# EAGLE design RecoveryBoard (EAGLE 9.5.1)

## Sheet 1 of 2: Power
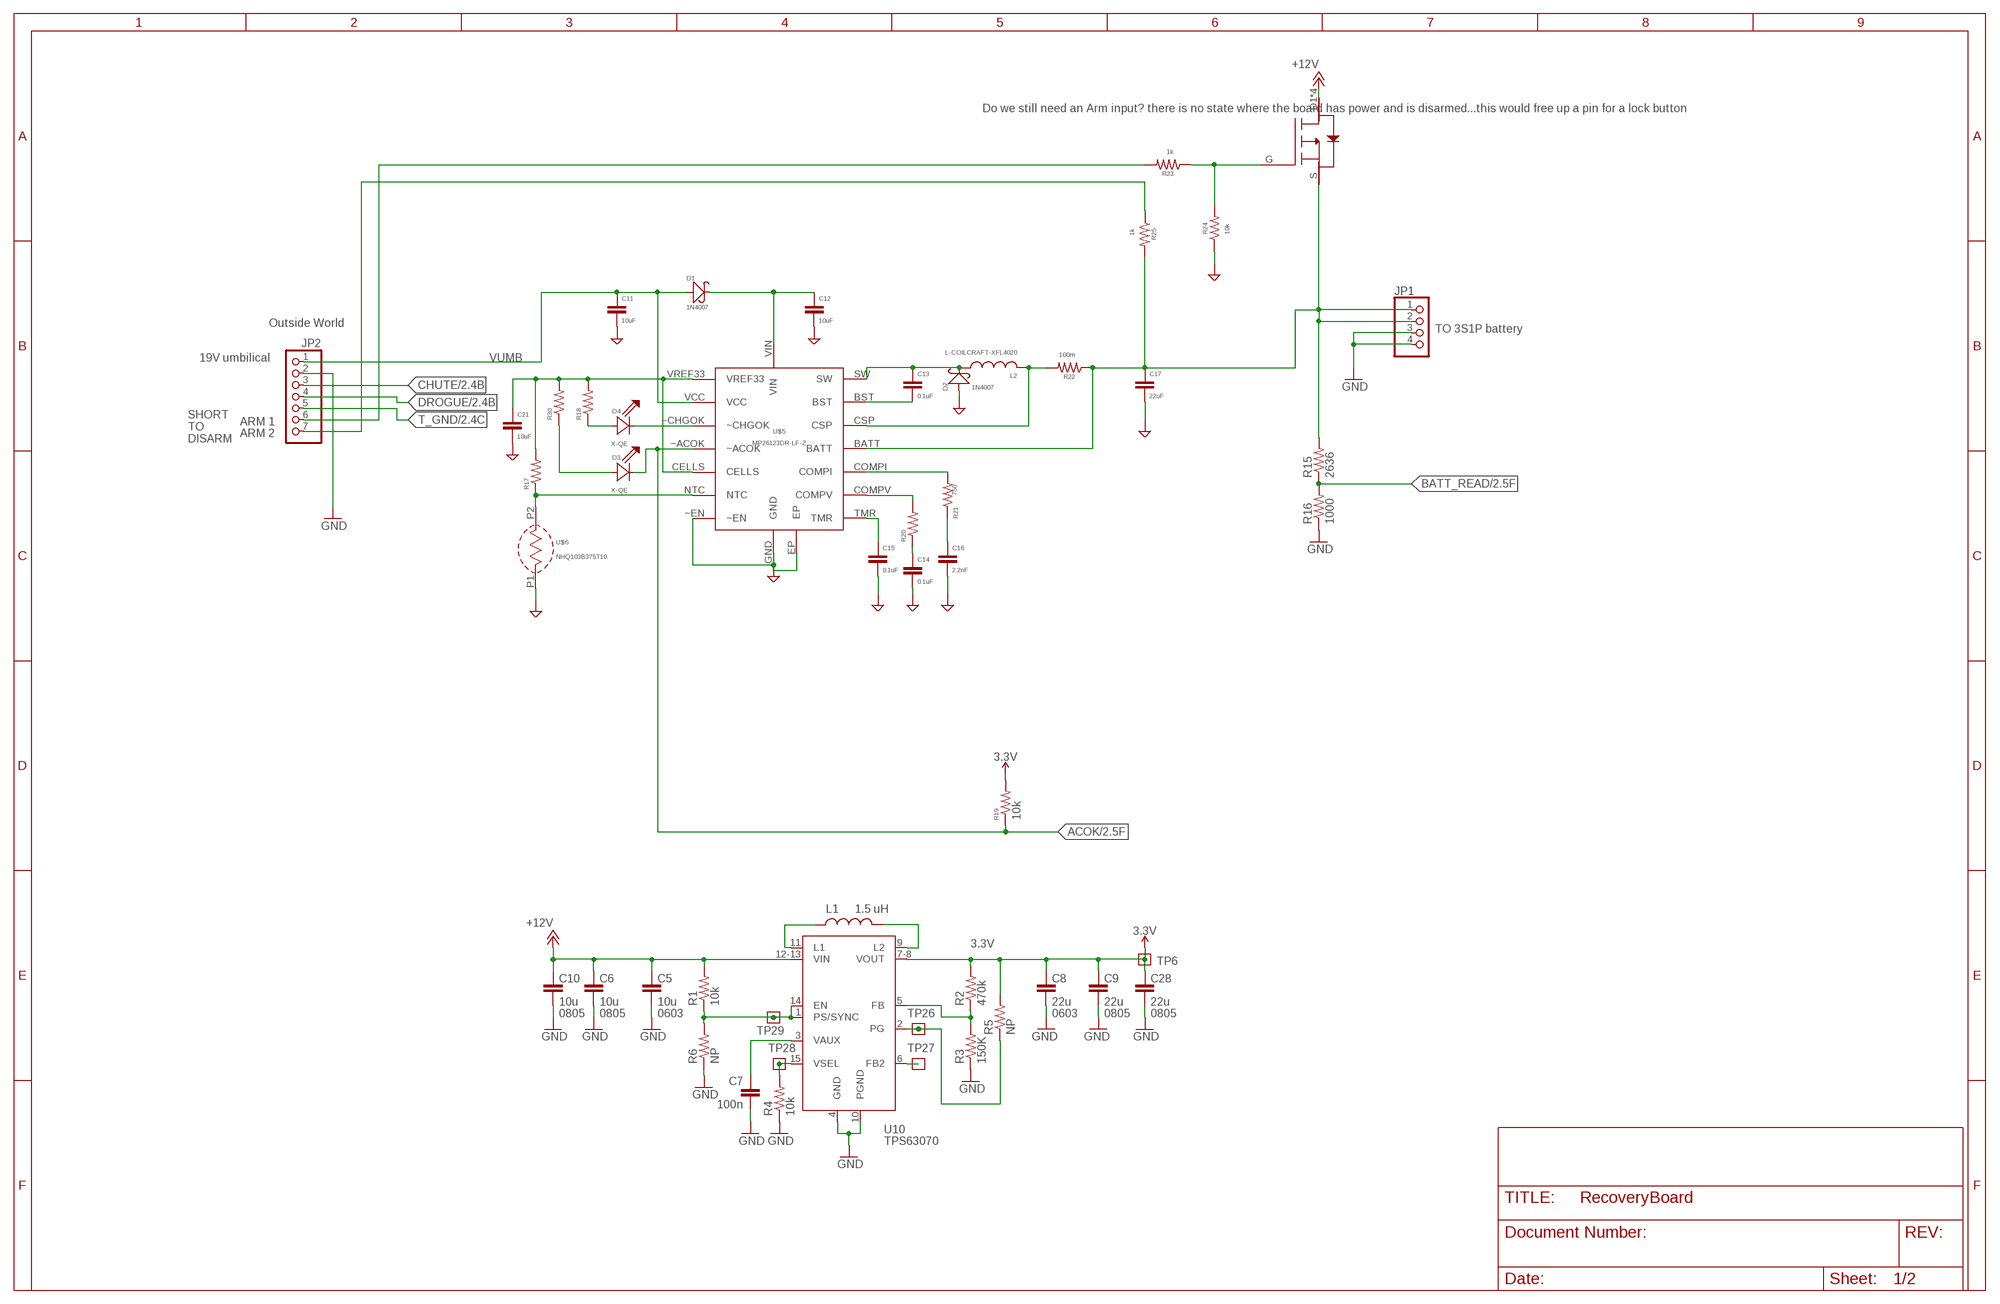
[diagram p0: schematic, sheet 1]

### Parts
C5  10u  C-EU0603-B-NOSILK  [.0603-B-NOSILK]
C6  10u  C-EU0805-B-NOSILK  [.0805-B-NOSILK]
C7  100n  C-EU0402-B-NOSILK  [.0402-B-NOSILK]
C8  22u  C-EU0603-B-NOSILK  [.0603-B-NOSILK]
C9  22u  C-EU0805-B-NOSILK  [.0805-B-NOSILK]
C10  10u  C-EU0805-B-NOSILK  [.0805-B-NOSILK]
C11  10uF  C-EU0805-C-NOSILK  [.0805-C-NOSILK]
C12  10uF  C-EU0805-C-NOSILK  [.0805-C-NOSILK]
C13  0.1uF  C-EU0603-C-NOSILK  [.0603-C-NOSILK]
C14  0.1uF  C-EU0603-C-NOSILK  [.0603-C-NOSILK]
C15  0.1uF  C-EU0603-C-NOSILK  [.0603-C-NOSILK]
C16  2.2nF  C-EU0603-C-NOSILK  [.0603-C-NOSILK]
C17  22uF  C-EU0603-C-NOSILK  [.0603-C-NOSILK]
C21  10uF  C-EU0805-C-NOSILK  [.0805-C-NOSILK]
C28  22u  C-EU0805-B-NOSILK  [.0805-B-NOSILK]
D1  1N4007  DIODE-SCHOTTKY-(DO-214AC)  [DO-214AC]
D2  1N4007  DIODE-SCHOTTKY-(DO-214AC)  [DO-214AC]
D3  X-QE  [X-QE]
D4  X-QE  [X-QE]
JP1  PINHD-1X4  [1X04]
JP2  PINHD-1X7  [1X07]
L1  1.5 uH  L-COILCRAFT-XFL4020  [L-COILCRAFT-XFL4020]
L2  L-COILCRAFT-XFL4020  [L-COILCRAFT-XFL4020]
R1  10k  R-US_0402-B-NOSILK  [.0402-B-NOSILK]
R2  470k  R-US_0402-B-NOSILK  [.0402-B-NOSILK]
R3  150K  R-US_0402-B-NOSILK  [.0402-B-NOSILK]
R4  10k  R-US_0402-B-NOSILK  [.0402-B-NOSILK]
R5  NP  R-US_0402-B-NOSILK  [.0402-B-NOSILK]
R6  NP  R-US_0402-B-NOSILK  [.0402-B-NOSILK]
R15  2636  R-US_0603-C-NOSILK  [.0603-C-NOSILK]
R16  1000  R-US_0603-C-NOSILK  [.0603-C-NOSILK]
R17  R-US_0603-C-NOSILK  [.0603-C-NOSILK]
R18  R-US_0603-C-NOSILK  [.0603-C-NOSILK]
R19  10k  R-US_0603-C-NOSILK  [.0603-C-NOSILK]
R20  R-US_0603-C-NOSILK  [.0603-C-NOSILK]
R21  750  R-US_0603-C-NOSILK  [.0603-C-NOSILK]
R22  100m  R-US_1206-C  [1206-C]
R23  1k  R-US_0603-C-NOSILK  [.0603-C-NOSILK]
R24  10k  R-US_0603-C-NOSILK  [.0603-C-NOSILK]
R25  1k  R-US_0603-C-NOSILK  [.0603-C-NOSILK]
R30  R-US_0603-C-NOSILK  [.0603-C-NOSILK]
TP6  TEST-POINT  [2MM-TEST-POINT]
TP26  TEST-POINT  [2MM-TEST-POINT]
TP27  TEST-POINT  [2MM-TEST-POINT]
TP28  TEST-POINT  [2MM-TEST-POINT]
TP29  TEST-POINT  [2MM-TEST-POINT]
U10  TPS63070  TPS63070X  [TPS63070X]
U$5  MP26123DR-LF-Z  [MP26123DR-LF-Z]
U$6  NHQ103B375T10  [NHQ103B375T10]
U$8  AO6405  [AO6405]

### Nets
3.3V: C8.1 C9.1 C28.1 R2.2 R5.2 R19.2 TP6.1 U10.7-8(VOUT) ; also sheet 2
+12V: C5.1 C6.1 C10.1 R1.2 U10.12-13(VIN) U$8.D1(D) U$8.D2(D) U$8.D3(D) U$8.D4(D) ; also sheet 2
ACOK: D3.CATHODE(C) R19.1 U$5.~ACOK ; also sheet 2
BATT_READ: R15.1 R16.2 ; also sheet 2
CHUTE: JP2.3 ; also sheet 2
DROGUE: JP2.4 ; also sheet 2
GND: C5.2 C6.2 C7.2 C8.2 C9.2 C10.2 C11.2 C12.2 C14.2 C15.2 C16.2 C17.2 C21.2 C28.2 D2.1(+) JP1.3 JP1.4 JP2.2 R3.1 R4.1 R6.1 R16.1 R24.1 U10.4(GND) U10.10(PGND) U$5.EP U$5.GND U$5.~EN U$6.P1 ; also sheet 2
N$9: C12.1 D1.2(-) U$5.VIN
N$10: C13.1 D2.2(-) L2.1 U$5.SW
N$11: C13.2 U$5.BST
N$12: C21.1 R17.2 R18.2 R30.2 U$5.CELLS U$5.VREF33
N$13: D4.CATHODE(C) U$5.~CHGOK
N$14: D3.ANODE(A) R30.1
N$15: JP2.6 R23.2
N$16: R23.1 R24.2 U$8.G
N$17: D4.ANODE(A) R18.1
N$18: R20.2 U$5.COMPV
N$19: C15.1 U$5.TMR
N$20: R17.1 U$5.NTC U$6.P2
N$21: R21.2 U$5.COMPI
N$22: C16.1 R21.1
N$23: C17.1 JP1.1 JP1.2 R15.2 R22.1 R25.2 U$5.BATT U$8.S
N$28: L2.2 R22.2 U$5.CSP
N$30: C14.1 R20.1
T_GND: JP2.5 ; also sheet 2
TPS-EN: R1.1 R6.2 TP29.1 U10.1(PS/SYNC) U10.14(EN)
TPS-FB: R2.1 R3.2 U10.5(FB)
TPS-FB2: TP27.1 U10.6(FB2)
TPS-L1: L1.1 U10.11(L1)
TPS-L2: L1.2 U10.9(L2)
TPS-PG: R5.1 TP26.1 U10.2(PG)
TPS-VAUX: C7.1 U10.3(VAUX)
TPS-VSEL: R4.2 TP28.1 U10.15(VSEL)
VBAT: JP2.7 R25.1
VUMB: C11.1 D1.1(+) JP2.1 U$5.VCC

### Notes on the sheet
- Do we still need an Arm input? there is no state where the board has power and is disarmed...this would free up a pin for a lock button
- Outside World
- TO 3S1P battery
- 19V umbilical
- ARM 1
- ARM 2
- SHORT
  TO
  DISARM
- 0805 | 0805 | 0603 | 0603 | 0805 | 0805

## Sheet 2 of 2: Microcontroller
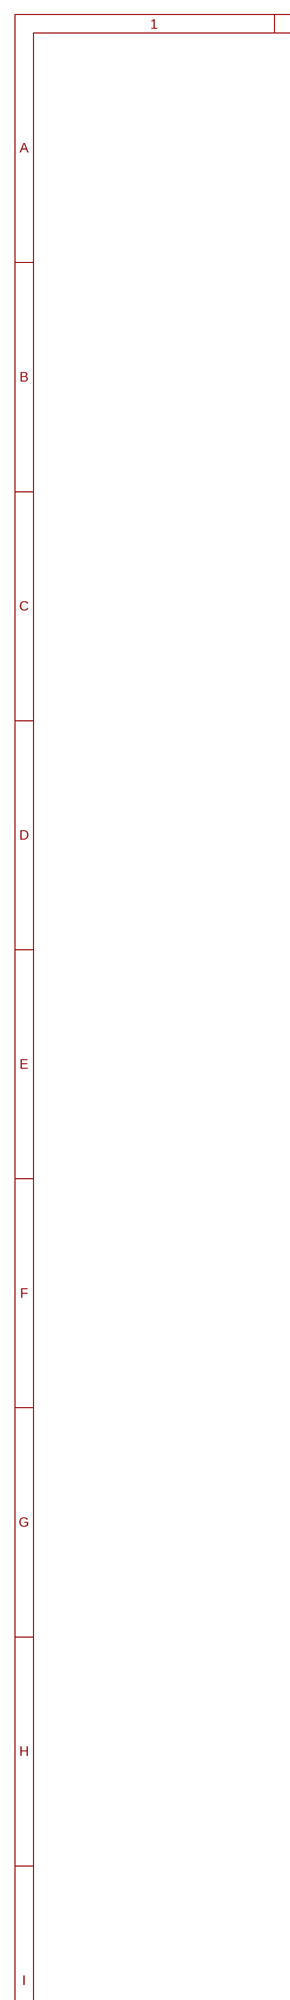
[diagram p1: schematic, sheet 2, part 1 of 2]
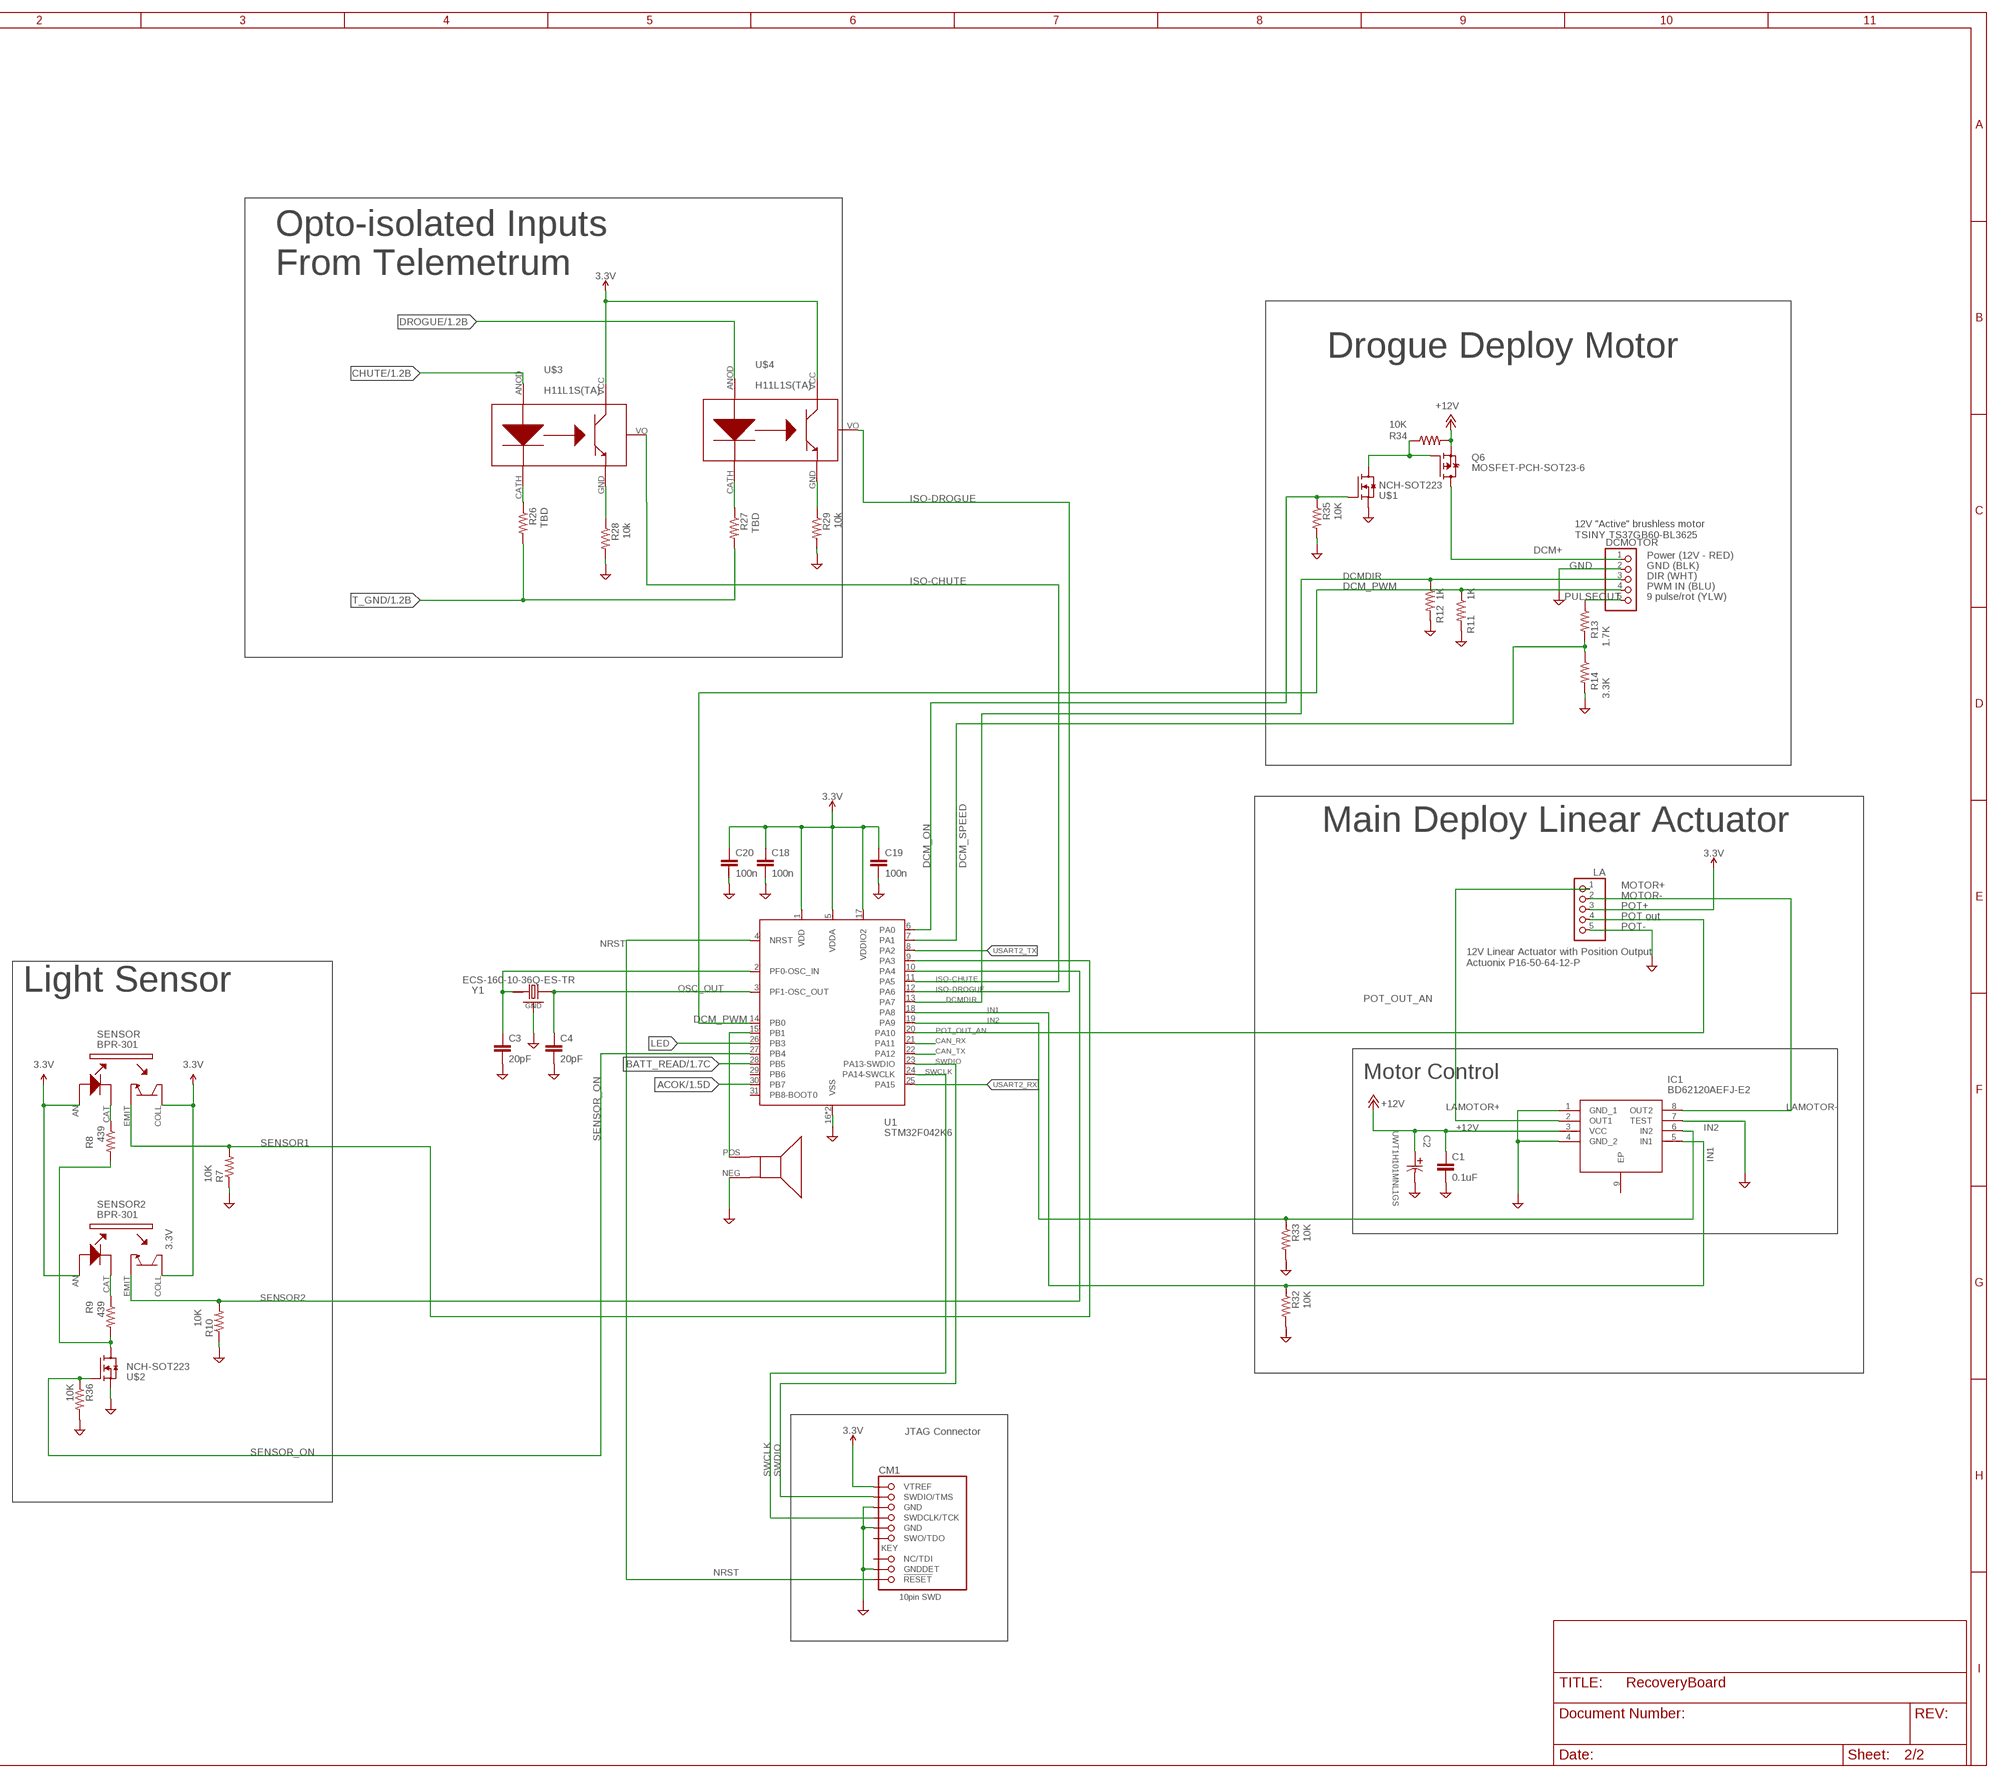
[diagram p2: schematic, sheet 2, part 2 of 2]

### Parts
C1  0.1uF  C-EUC0402  [C0402]
C2  UWT1H101MNL1GS  [PCAP_8X10-ELECT]
C3  20pF  C-EUC0402  [C0402]
C4  20pF  C-EUC0402  [C0402]
C18  100n  C-EUC0402  [C0402]
C19  100n  C-EUC0402  [C0402]
C20  100n  C-EUC0402  [C0402]
CM1  FTSH-105-XX-X-DV-K  [CON10_2X5_DUK_FTSH]
DCMOTOR  PINHD-1X5  [1X05]
IC1  BD62120AEFJ-E2  [SOIC127P600X100-9N]
LA  PINHD-1X5  [1X05]
Q6  MOSFET-PCH-SOT23-6  [SOT23-6]
R7  10K  R-US_R0402  [R0402]
R8  439  R-US_R0402  [R0402]
R9  439  R-US_R0402  [R0402]
R10  10K  R-US_R0402  [R0402]
R11  1K  R-US_R0402  [R0402]
R12  1K  R-US_R0402  [R0402]
R13  1.7K  R-US_R0402  [R0402]
R14  3.3K  R-US_R0402  [R0402]
R26  TBD  R-US_R0402  [R0402]
R27  TBD  R-US_R0402  [R0402]
R28  10k  R-US_R0402  [R0402]
R29  10k  R-US_R0402  [R0402]
R32  10K  R-US_R0402  [R0402]
R33  10K  R-US_R0402  [R0402]
R34  10K  R-US_R0402  [R0402]
R35  10K  R-US_R0402  [R0402]
R36  10K  R-US_R0402  [R0402]
SENSOR  BPR-301  [BPR-301]
SENSOR2  BPR-301  [BPR-301]
U1  STM32F042K6  [QFP32-7X7]
U$1  NCH-SOT223  [SOT223]
U$2  NCH-SOT223  [SOT223]
U$3  H11L1S(TA)  [H11L1S(TA)]
U$4  H11L1S(TA)  [H11L1S(TA)]
U$7  SMT-0440-S-R  [SMT-0440-S-R]
Y1  ECS-160-10-36Q-ES-TR  [XTAL_ECS-160-10-36Q-ES-TR]

### Nets
3.3V: C18.1 C19.1 C20.1 CM1.1(VTREF) LA.3 SENSOR2.AN(ANOD) SENSOR2.COLL SENSOR.AN(ANOD) SENSOR.COLL U1.1(VDD) U1.5(VDDA) U1.17(VDDIO2) U$3.VCC(COLL) U$4.VCC(COLL) ; also sheet 1
+12V: C1.1 C2.1 IC1.3(VCC) Q6.4(S) R34.2 ; also sheet 1
ACOK: U1.30(PB7) ; also sheet 1
BATT_READ: U1.28(PB5) ; also sheet 1
CAN_RX: U1.21(PA11)
CAN_TX: U1.22(PA12)
CHUTE: U$3.ANOD ; also sheet 1
DCM+: DCMOTOR.1 Q6.1(D) Q6.2(D) Q6.5(D) Q6.6(D)
DCM_ON: R35.1 U1.6(PA0) U$1.1(G)
DCM_PWM: DCMOTOR.4 R11.1 U1.14(PB0)
DCM_SPEED: R13.2 R14.1 U1.7(PA1)
DCMDIR: DCMOTOR.3 R12.1 U1.13(PA7)
DROGUE: U$4.ANOD ; also sheet 1
GND: C1.2 C2.2 C3.2 C4.2 C18.2 C19.2 C20.2 CM1.3(GND) CM1.5(GND) CM1.9(GNDDET) DCMOTOR.2 IC1.1(GND_1) IC1.4(GND_2) IC1.7(TEST) LA.5 R7.1 R10.1 R11.2 R12.2 R14.2 R28.2 R29.2 R32.2 R33.2 R35.2 R36.2 U1.16(VSS) U1.32(VSS) U$1.3(S) U$2.3(S) U$7.NEG Y1.GND Y1.GND2(GND) ; also sheet 1
IN1: IC1.5(IN1) R32.1 U1.18(PA8)
IN2: IC1.6(IN2) R33.1 U1.19(PA9)
ISO-CHUTE: U1.11(PA5) U$3.VO(OUTPUT)
ISO-DROGUE: U1.12(PA6) U$4.VO(OUTPUT)
LAMOTOR+: IC1.2(OUT1) LA.1
LAMOTOR-: IC1.8(OUT2) LA.2
LED: U1.26(PB3)
N$2: R8.1 SENSOR.CAT(CATH)
N$3: C3.1 U1.2(PF0-OSC_IN) Y1.IN/OUT
N$5: R9.1 SENSOR2.CAT(CATH)
N$6: Q6.3(G) R34.1 U$1.2(D) U$1.4(D)
N$7: R26.1 U$3.CATH(CAT)
N$24: U1.15(PB1) U$7.POS
N$25: R28.1 U$3.GND(EMIT)
N$26: R27.1 U$4.CATH(CAT)
N$27: R8.2 R9.2 U$2.2(D) U$2.4(D)
N$29: R29.1 U$4.GND(EMIT)
NRST: CM1.10(!RESET) U1.4(NRST)
OSC_OUT: C4.1 U1.3(PF1-OSC_OUT) Y1.OUT/IN
POT_OUT_AN: LA.4 U1.20(PA10)
PULSEOUT: DCMOTOR.5 R13.1
SENSOR1: R7.2 SENSOR.EMIT U1.9(PA3)
SENSOR2: R10.2 SENSOR2.EMIT U1.10(PA4)
SENSOR_ON: R36.1 U1.27(PB4) U$2.1(G)
SWCLK: CM1.4(SWDCLK/TCK) U1.24(PA14-SWCLK)
SWDIO: CM1.2(SWDIO/TMS) U1.23(PA13-SWDIO)
T_GND: R26.2 R27.2 ; also sheet 1
USART2_RX: U1.25(PA15)
USART2_TX: U1.8(PA2)
Unconnected: CM1.6(SWO/TDO) CM1.8(NC/TDI) IC1.9(EP) U1.29(PB6) U1.31(PB8-BOOT0)

### Notes on the sheet
- Opto-isolated Inputs
  From Telemetrum
- Drogue Deploy Motor
- 12V "Active" brushless motor
  TSINY TS37GB60-BL3625
- Power (12V - RED)
- GND (BLK)
- DIR (WHT)
- PWM IN (BLU)
- 9 pulse/rot (YLW)
- Main Deploy Linear Actuator
- MOTOR+
- MOTOR-
- POT+
- POT out
- POT-
- 12V Linear Actuator with Position Output
  Actuonix P16-50-64-12-P
- Light Sensor
- Motor Control
- JTAG Connector

## Library data of the parts
C1 C3 C4 C18-C20 = rcl:C-EU: CAPACITOR, European symbol; SPICEPREFIX: C
C2 = UWT1H101MNL1GS:UWT1H101MNL1GS; BUILT_BY: EMA_UL_Team; MANUFACTURER_PART_NUMBER: UWT1H101MNL1GS; VENDOR: Nichicon
C5 C8 = oresat-rcl:C-EU: CAPACITOR, European symbol; DIS: Digi-Key; DPN: 1276-1001-1-ND; MFR: Samsung; MPN: CL05B104KO5NNNC
C6 C9-C17 C21 C28 = oresat-rcl:C-EU: CAPACITOR, European symbol
C7 = rcl_custom:C-EU: CAPACITOR, European symbol; DIS: Digi-Key; DPN: 1276-1001-1-ND; MFR: Samsung; MPN: CL05B104KO5NNNC
CM1 = J-Samtec-FTSH-105-XXX-DV-K-ARM-SWD:FTSH-105-XX-X-DV-K
D1 D2 = D-Generic-Schottky-DO-214AC-SMA:DIODE-SCHOTTKY-(DO-214AC): 304010013; MPN: 1N4007
D3 D4 = D-Cree-XQE-LED:X-QE
DCMOTOR LA = pinhead:PINHD-1X5: PIN HEADER
IC1 = SamacSys_Parts:BD62120AEFJ-E2: ROHM BD62120AEFJ-E2 Motor Driver IC 8-Pin, HTSOP-J Source: Datasheet <https://componentsearchengine.com/Datasheets/1/BD62120AEFJ-E2.pdf>; DESCRIPTION: ROHM BD62120AEFJ-E2 Motor Driver IC 8-Pin, HTSOP-J; HEIGHT: 1mm; MANUFACTURER_NAME: ROHM Semiconductor; MANUFACTURER_PART_NUMBER: BD62120AEFJ-E2; MOUSER_PART_NUMBER: 755-BD62120AEFJ-E2; MOUSER_PRICE-STOCK: https://www.mouser.com/Search/Refine.aspx?Keyword=755-BD62120AEFJ-E2
JP1 = pinhead:PINHD-1X4: PIN HEADER
JP2 = pinhead:PINHD-1X7: PIN HEADER
L1 = L-Coilcraft-XFL4020:L-COILCRAFT-XFL4020; DIS: Mouser; DPN: 994-XFL4020-152MEB; MFR: Coilcraft; MPN: XFL4020-152ME
L2 = L-Coilcraft-XFL4020:L-COILCRAFT-XFL4020
Q6 = Q-MOSFET-PCH-SOT23-6:MOSFET-PCH-SOT23-6: P channel MOSFET in an SOT23-6
R1-R6 = rcl_custom:R-US_: RESISTOR, American symbol; DIS: Digi-Key; DPN: 1276-4275-1-ND; MFR: Samsung; MPN: RC1005F6653CS
R7-R14 R26-R29 R32-R36 = rcl:R-US_: RESISTOR, American symbol; SPICEPREFIX: R
R15 R16 = oresat-rcl:R-US_: RESISTOR, American symbol; DIS: Digi-Key; DPN: 1276-4275-1-ND; MFR: Samsung; MPN: RC1005F6653CS
R17-R25 R30 = oresat-rcl:R-US_: RESISTOR, American symbol
SENSOR SENSOR2 = BPR-301:BPR-301; DATASHEET: http://americanbrightled.com/pdffiles/infrared/BPR-301.pdf; DIS: DigiKey; DPN: BPR-301-ND; MPN: BPR-301
TP6 TP26-TP29 = Tova:TEST-POINT
U1 = U-ST-STM32F042K-uC:STM32F042K6
U10 = ic-pwr-tps63070x:TPS63070X: TPS63070 2-V to 16-V Buck-Boost Converter With 3.6-A Switch Current
U$1 U$2 = Q-MOSFET-NCH-SOT223:NCH-SOT223
U$3 U$4 = Q--H11L1S(TA)--OptoIsolator:H11L1S(TA)
U$5 = U--MP26123DR-LF-Z--LiPo Charger:MP26123DR-LF-Z
U$6 = R--NHQ103B375T10--Thermistor:NHQ103B375T10
U$7 = SPK--SMT-0440-S-R--Speaker:SMT-0440-S-R
U$8 = Q--AO6405--P-CH MOSFET for Arm Switch:AO6405; DIS: DigiKey; DPN: 785-1072-1-ND; MPN: AO6405
Y1 = ECS-160-10-36Q-ES-TR:ECS-160-10-36Q-ES-TR: The ECX-2236Q is a miniature SMD Crystal with a 2.5 x 2.0 mm; DESCRIPTION: Crystal 16MHz ±30ppm _Tol_ ±50ppm _Stability_ 10pF FUND 80Ohm Automotive 4-Pin SMD T/R; DIGI-KEY_PART_NUMBER: XC2181CT-ND; DIGI-KEY_PURCHASE_URL: https://www.digikey.com/product-detail/en/ecs-inc/ECS-160-10-36Q-ES-TR/XC2181CT-ND/6134150?utm_source=snapeda&utm_medium=aggregator&utm_campaign=symbol; MF: ECS Inc.; MP: ECS-160-10-36Q-ES-TR; PACKAGE: SMD-4 ECS International

## Board
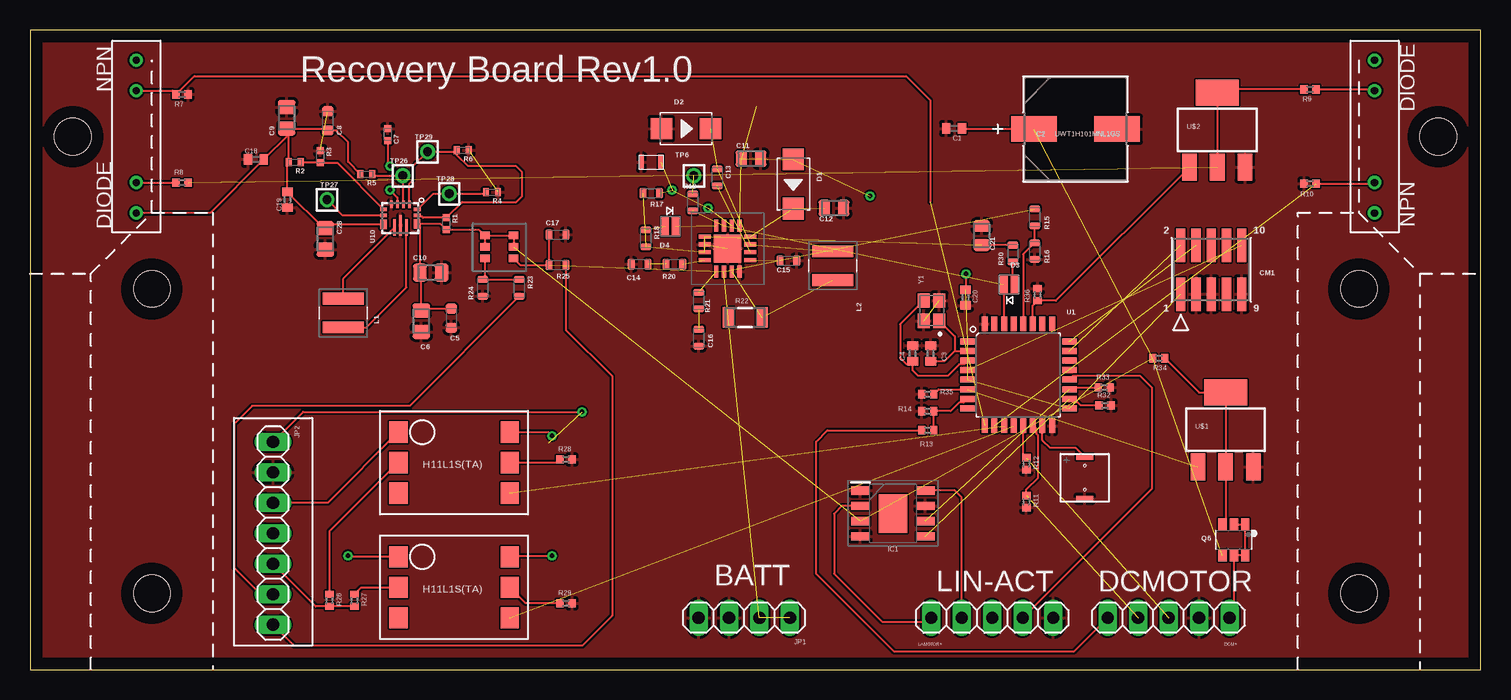
[diagram p3: board, top side]
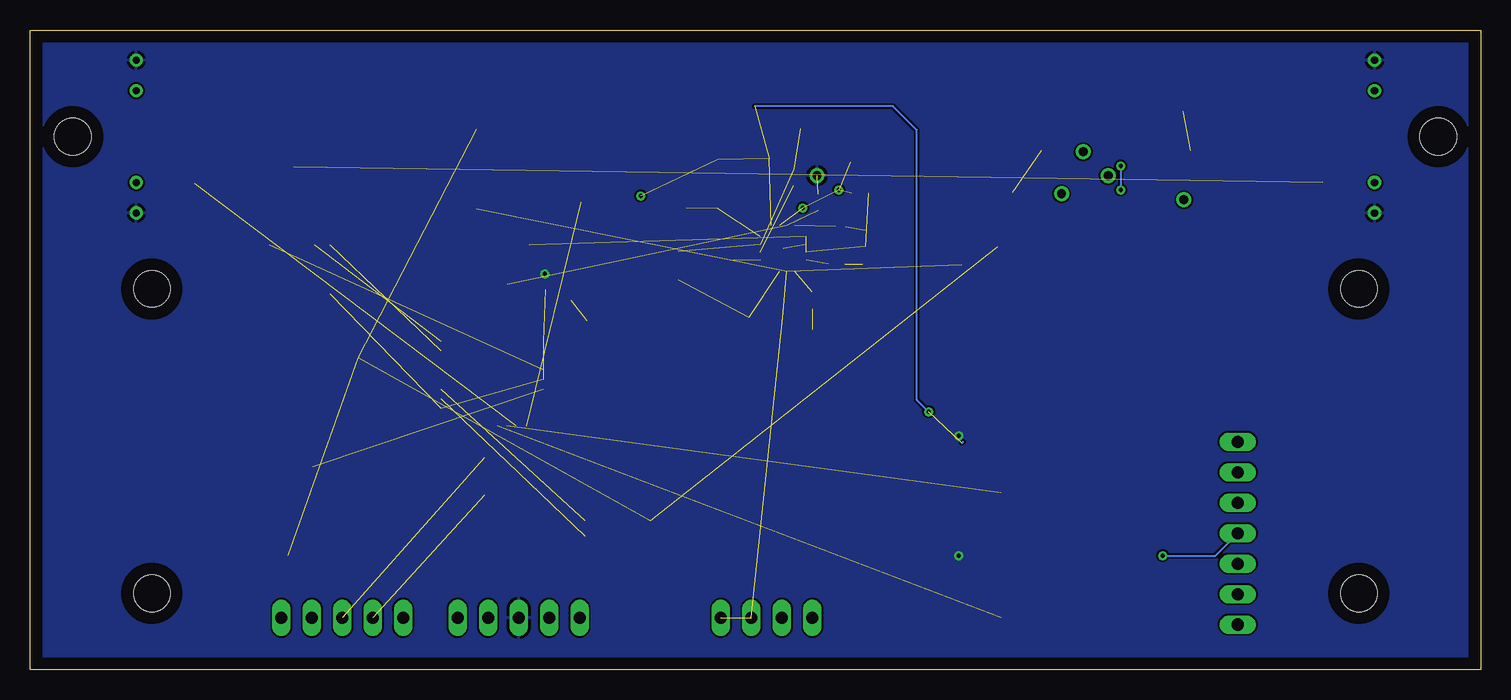
[diagram p4: board, bottom side, seen from below]

Size 120.9 x 53.34 mm. Coordinates in mm from the lower left corner, seen from the top.
Outline: 0,0 120.9,0 120.9,53.34 0,53.34 0,0
Copper layers (1*16): Top 0.035mm / dielectric 1.5mm / Bottom 0.035mm
Design rules "default": minimum track width 6mil, minimum drill 0.35mm, track to track 6mil, track to pad 6mil, pad to pad 6mil, via to via 6mil, smd to smd 6mil, copper to edge 40mil, drill to drill 6mil, minimum pad ring 10mil, minimum via ring 8mil, stop-mask expansion 4mil, vias tented up to drill 0mil, thermal gap 10mil
Holes 3.05 mm at 3.56,44.45 117.35,44.45 10.16,6.35 10.16,31.75 110.74,31.75 110.74,6.35

### Footprints (pad centres in the part's own frame; a part is rotated, then mirrored left to right if it is on the bottom)
C0402 = smd 0.7 x 0.9: 1 -0.65,0; 2 0.65,0
PCAP_8X10-ELECT = smd 3.81 x 2.108: 1 -3.454,0; 2 3.454,0
.0603-B-NOSILK = smd 0.8 x 0.95: 1 -0.8,0; 2 0.8,0
.0805-B-NOSILK = smd 1.15 x 1.45: 1 -0.9,0; 2 0.9,0
.0402-B-NOSILK = smd 0.6 x 0.7: 1 -0.5,0; 2 0.5,0
.0805-C-NOSILK = smd 0.95 x 1.35: 1 -0.8,0; 2 0.8,0
.0603-C-NOSILK = smd 0.6 x 0.9: 1 -0.7,0; 2 0.7,0
CON10_2X5_DUK_FTSH = smd 0.762 x 2.794: 1 -2.54,-2.032; 2 -2.54,2.032; 3 -1.27,-2.032; 4 -1.27,2.032; 5 0,-2.032; 6 0,2.032; 7 1.27,-2.032; 8 1.27,2.032; 9 2.54,-2.032; 10 2.54,2.032
DO-214AC = smd 1.8 x 1.77: 1 -2.042,0; 2 2.042,0
X-QE = smd 0.65 x 1.6: ANODE -0.45,0; CATHODE 0.45,0
1X05 = drill 1.016 long: 1 -5.08,0; 2 -2.54,0; 3 0,0; 4 2.54,0; 5 5.08,0
SOIC127P600X100-9N = smd 1.525 x 0.7: 1 -2.712,1.905; 2 -2.712,0.635; 3 -2.712,-0.635; 4 -2.712,-1.905; 5 2.712,-1.905; 6 2.712,-0.635; 7 2.712,0.635; 8 2.712,1.905 | smd 2.4 x 3.2: 9 0,0
1X04 = drill 1.016 long: 1 -3.81,0; 2 -1.27,0; 3 1.27,0; 4 3.81,0
1X07 = drill 1.016 long: 1 -7.62,0; 2 -5.08,0; 3 -2.54,0; 4 0,0; 5 2.54,0; 6 5.08,0; 7 7.62,0
L-COILCRAFT-XFL4020 = smd 0.98 x 3.4: 1 -1.2,0; 2 1.2,0
SOT23-6 = smd 0.7 x 1: 1 -0.95,-1.3; 2 0,-1.3; 3 0.95,-1.3; 4 0.95,1.3; 5 0,1.3; 6 -0.95,1.3
R0402 = smd 0.6 x 0.7: 1 -0.5,0; 2 0.5,0
1206-C = smd 0.95 x 1.7: 1 -1.4,0; 2 1.4,0
BPR-301 = drill 0.6: AN -6.37,0; CAT -3.83,0; COLL 6.37,0; EMIT 3.83,0
2MM-TEST-POINT = drill 0.737: 1 0,0
QFP32-7X7 = smd 1.2 x 0.5: 1 -4.25,2.8; 2 -4.25,2; 3 -4.25,1.2; 4 -4.25,0.4; 5 -4.25,-0.4; 6 -4.25,-1.2; 7 -4.25,-2; 8 -4.25,-2.8; 17 4.25,-2.8; 18 4.25,-2; 19 4.25,-1.2; 20 4.25,-0.4; 21 4.25,0.4; 22 4.25,1.2; 23 4.25,2; 24 4.25,2.8 | smd 0.5 x 1.2: 9 -2.8,-4.25; 10 -2,-4.25; 11 -1.2,-4.25; 12 -0.4,-4.25; 13 0.4,-4.25; 14 1.2,-4.25; 15 2,-4.25; 16 2.8,-4.25; 25 2.8,4.25; 26 2,4.25; 27 1.2,4.25; 28 0.4,4.25; 29 -0.4,4.25; 30 -1.2,4.25; 31 -2,4.25; 32 -2.8,4.25
TPS63070X = smd 0.6 x 0.25: 1 -1.15,0.75; 2 -1.15,0.25; 3 -1.15,-0.25; 4 -1.15,-0.75 | smd 0.25 x 0.6: 5 -0.725,-1.4; 6 -0.225,-1.4; 14 -0.225,1.4; 15 -0.725,1.4 | smd 0.75 x 0.6: 7-8 0.525,-1.4; 12-13 0.475,1.4 | smd 1.35 x 0.25: 9 0.775,-0.5; 11 0.775,0.5 | smd 1.7 x 0.25: 10 0.6,0
SOT223 = smd 1.219 x 2.235: 1 -2.311,-3.099; 2 0,-3.099; 3 2.311,-3.099 | smd 3.6 x 2.2: 4 0,3.099
H11L1S(TA) = smd 1.52 x 1.78: ANOD 0,0; CATH 0,-2.54; GND 9.27,-2.54; P2 0,-5.08; VCC 9.27,0; VO 9.27,-5.08
MP26123DR-LF-Z = smd 1 x 0.35: BATT 1.9,-0.3; COMPI 1.9,-0.95; CSP 1.9,0.35; GND 1.9,1; NTC -1.9,0.35; VCC -1.9,1; ~ACOK -1.9,-0.3; ~CHGOK -1.9,-0.95 | smd 0.35 x 1: BST 0.3,1.9; CELLS 0.3,-1.9; COMPV 0.95,-1.9; SW -0.35,1.9; TMR 0.95,1.9; VIN -1,1.9; VREF33 -1,-1.9; ~EN -0.35,-1.9 | smd 2.3 x 2.3: EP 0,0
NHQ103B375T10 = smd 0.4 x 1.25: P1 -0.8,0; P2 0.8,0
SMT-0440-S-R = smd 0.5 x 1.4: NEG -1.75,0; POS 1.75,0
AO6405 = smd 0.63 x 0.8: D1 0,0; D2 0.95,0; D3 0,2.4; D4 0.95,2.4; G 1.9,0; S 1.9,2.4
XTAL_ECS-160-10-36Q-ES-TR = smd 1.2 x 1: GND -0.85,0.65; GND2 0.85,-0.65; IN/OUT -0.85,-0.65; OUT/IN 0.85,0.65

### Placement (x,y rotation side)
C1  77,45.13 180 top
C2  87.12,45.08 0 top
C3  75.05,26.37 90 top
C4  73.55,26.37 90 top
C5  35.11,29.31 270 top
C6  32.61,29.06 270 top
C7  29.81,44.62 90 top
C8  24.81,45.76 90 top
C9  21.39,46.01 90 top
C10  33.4,33.11 0 top
C11  60.08,42.61 0 top
C12  67,38.5 0 top
C13  57.27,41.05 270 top
C14  50.8,33.8 180 top
C15  63.2,34.1 0 top
C16  55.73,27.67 270 top
C17  43.96,36.27 0 top
C18  18.83,42.55 180 top
C19  21.45,39.18 270 top
C20  77.95,31.03 270 top
C21  79.3,36.2 90 top
C28  24.61,35.91 270 top
CM1  98.44,33.35 0 top
D1  63.61,40.49 270 top
D2  54.66,45.11 0 top
D3  81.59,32.1 180 top
D4  53.37,36.96 0 top
DCMOTOR  94.88,4.33 180 top
IC1  71.91,13.02 0 top
JP1  59.52,4.33 180 top
JP2  20.25,11.37 270 top
L1  26.1,29.74 90 top
L2  66.9,33.68 270 top
LA  80.18,4.33 0 top
Q6  100.32,10.81 180 top
R1  34.69,37.19 270 top
R2  22.07,42.31 180 top
R3  24.19,42.76 270 top
R4  38.5,39.81 180 top
R5  28.04,41.31 180 top
R6  36.08,43.31 180 top
R7  12.67,47.97 180 top
R8  12.67,40.61 0 top
R9  106.67,48.39 180 top
R10  106.67,40.53 0 top
R11  83.03,14.01 270 top
R12  83.03,17.17 270 top
R13  74.81,19.95 0 top
R14  74.81,21.55 180 top
R15  83.73,37.71 90 top
R16  83.73,34.9 90 top
R17  51.77,39.73 180 top
R18  51.31,35.97 270 top
R19  55.23,38.97 90 top
R20  53.7,33.8 0 top
R21  55.73,30.78 90 top
R22  59.59,29.37 0 top
R23  40.77,31.84 270 top
R24  37.73,31.84 90 top
R25  43.96,33.73 180 top
R26  24.95,5.77 270 top
R27  27.03,5.77 270 top
R28  44.67,17.53 0 top
R29  44.67,5.53 0 top
R30  81.9,34.7 90 top
R32  89.59,22.03 0 top
R33  89.51,23.53 0 top
R34  94.07,25.97 180 top
R35  74.81,22.97 180 top
R36  83.97,31.27 90 top
SENSOR  8.86,44.45 90 top
SENSOR2  112.05,44.45 270 top
TP6  55.32,41.19 0 top
TP26  31.06,41.19 0 top
TP27  24.75,39.19 0 top
TP28  34.94,39.69 0 top
TP29  33.13,43.19 0 top
U1  82.37,24.58 0 top
U10  30.87,37.65 270 top
U$1  99.64,20.01 0 top
U$2  98.94,45.01 0 top
U$3  30.7,19.8 0 top
U$4  30.7,9.4 0 top
U$5  58.13,35.11 270 top
U$6  51.75,42.31 0 top
U$7  87.89,16 90 top
U$8  37.9,36.2 270 top
Y1  75.13,29.93 90 top

### Tracks (layer width: path | path; a pad name or v marks a point on that pad's centre or on a via)
3.3V  (via drill 0.35)  (5 unrouted)
  Top 0.152: C20.1 78,31.73 v78,33 | 21.5,45 21.57,44.93 R2.2 21.45,42.19 C19.1 24.47,36.81 C28.1 24.93,37.12 U10.7-8 | 21.5,45 C9.1 24.66,45.11 C8.1 25.54,44.96 26.5,44 26.5,42.35 R5.2 | 21.5,45 21.5,44.57 C18.1 15.01,38.08 SENSOR.AN | U$4.VCC 40.07,9.5 v43.5,9.5 | U$3.VCC 43.2,19.8 v43.5,19.5
  pour Bottom: 0,0 0,54 121,54 121,0
+12V  (4 unrouted)
  Top 0.152: C2.1 77.7,45.08 C1.1 | U10.12-13 32.5,37.17 | 32.5,37.17 34.2,37.17 R1.2 37.41,36.69 U$8.D1 | U$8.D1 U$8.D3 U$8.D4 | U$8.D1 U$8.D2 | C5.1 32.76,30.11 C6.1 32.61,33 C10.1 32.5,37.17
ACOK  (2 unrouted)
  Top 0.152: D3.CATHODE 81.14,28.86 U1.30
BATT_READ
  Top 0.152: U1.28 82.77,34.64 R16.2 R15.1
CHUTE
  Top 0.152: U$3.ANOD 24.81,13.91 JP2.3
DCM+
  Top 0.152: Q6.2 Q6.1 Q6.6 Q6.5 100.32,4.68 DCMOTOR.1
DCM_ON  (1 unrouted)
  Top 0.152: R35.1 75.72,23.38 U1.6
DCM_PWM  (1 unrouted)
  Top 0.152: R11.1 83.03,15.03 84,16 84,19.53 83.89,19.64 83.89,20.01 U1.14
DCM_SPEED
  Top 0.152: U1.7 77.8,22.26 77.42,22.26 76.72,21.55 R14.1 R13.2
DCMDIR  (1 unrouted)
  Top 0.152: R12.1 82.77,17.93 U1.13
DROGUE  (via drill 0.35)
  Top 0.152: U$4.ANOD 26.6,9.4 v26.5,9.5
  Bottom 0.152: v26.5,9.5 22.12,9.5 JP2.4
GND  (4 unrouted)
  pour Top: 0,0 0,54 121,54 121,0
IN1  (1 unrouted)
  Top 0.152: U1.18 86.94,22.26 87.31,22.26 87.54,22.03 R32.1
IN2  (1 unrouted)
  Top 0.152: U1.19 86.77,23.53 R33.1
ISO-CHUTE  (1 unrouted)
ISO-DROGUE  (1 unrouted)
LAMOTOR+
  Top 0.152: IC1.2 67.66,13.65 67,13 67,8 71,4 74.78,4 LA.1
LAMOTOR-
  Top 0.152: LA.2 77.64,14.36 77.08,14.93 IC1.8
N$2
  Top 0.152: SENSOR.CAT R8.1
N$3
  Top 0.152: C3.1 76.22,25.72 77.08,26.58 | 77.08,26.58 U1.2 | Y1.IN/OUT 77.08,27.78 77.08,26.58
N$5
  Top 0.152: R9.1 111.94,48.39 SENSOR2.CAT
N$6
  Top 0.152: R34.1 97.43,23.11 U$1.4 U$1.2 99.64,12.38 Q6.3
N$7
  Top 0.152: U$3.CATH 24.95,11.51 R26.1
N$9  (2 unrouted)
N$10  (3 unrouted)
N$11  (1 unrouted)
N$12  (4 unrouted)
  Top 0.152: R30.2 C21.1
N$13  (1 unrouted)
N$14
  Top 0.152: D3.ANODE 81.9,32.24 R30.1
N$15
  Top 0.152: R23.2 31.63,22 18.5,22 17,20.5 17,8.5 19.21,6.29 JP2.6
N$16
  Top 0.152: R23.1 R24.2 37.9,32.71 U$8.G
N$17  (1 unrouted)
N$18  (1 unrouted)
N$19  (1 unrouted)
N$20  (via drill 0.35)  (4 unrouted)
  other vias: 56.5,38.5 53.5,40
N$21  (1 unrouted)
N$22  (1 unrouted)
N$23  (5 unrouted)
  Top 0.152: U$8.S 40.87,33.73 R25.2 C17.1
N$24
  Top 0.152: U$7.POS 87.14,18.5 85,18.5 84.37,19.13 U1.15
N$25
  Top 0.152: U$3.GND 43.9,17.26 R28.1
N$26
  Top 0.152: R27.1 27.62,6.86 U$4.CATH
N$27  (1 unrouted)
  Top 0.152: U$2.4 98.94,48 | 98.94,48 U$2.2 | R9.2 99.33,48.39 98.94,48
N$28  (2 unrouted)
N$29
  Top 0.152: R29.1 41.3,5.53 U$4.GND
N$30  (1 unrouted)
NRST  (1 unrouted)
OSC_OUT
  Top 0.152: U1.3 77.8,25.46 77.42,25.46 76.47,24.5 74,24.5 73.55,24.95 73.55,25.5 | 73.55,25.5 C4.1 | Y1.OUT/IN 72.5,28.8 72.5,26 73,25.5 73.55,25.5
POT_OUT_AN
  Top 0.152: LA.4 93.5,15.11 93.5,23.5 92.5,24.5 86.94,24.5 U1.20
PULSEOUT
  Top 0.152: DCMOTOR.5 86.97,1.5 72,1.5 65.5,8 65.5,19 66.45,19.95 R13.1
SENSOR1  (1 unrouted)
  Top 0.152: SENSOR.EMIT 11.86,48.28 R7.2 13.7,49.5 73,49.5 75,47.5 75,39
SENSOR2  (1 unrouted)
  Top 0.152: R10.2 111.96,40.53 SENSOR2.EMIT
SENSOR_ON
  Top 0.152: U1.27 83.57,30.37 R36.1 85.49,30.77 U$2.1
SWCLK  (1 unrouted)
SWDIO  (1 unrouted)
T_GND
  Top 0.152: JP2.5 23.81,5.27 R26.2 R27.2
TPS-EN
  Top 0.152: U10.14 32.37,37.78 32.65,37.78 32.74,37.69 R1.1 36,39 40.5,39 41,39.5 41,41.5 40.5,42 36.5,42 35.58,42.92 R6.2 35.46,43.19 TP29.1 31.91,41.97 31.91,40.84 31.62,40.55 U10.1
TPS-FB
  Top 0.152: R2.1 24.14,42.31 R3.2 25.59,42.26 U10.5
TPS-FB2
  Top 0.152: U10.6 26.07,37.88 TP27.1
TPS-L1
  Top 0.152: L1.1 28.04,28.54 31.37,31.87 U10.11
TPS-L2
  Top 0.152: L1.2 26.1,32.6 U10.9
TPS-PG
  Top 0.152: R5.1 28.66,41.19 TP26.1 31.06,38.86 U10.2
TPS-VAUX  (via drill 0.35)
  Top 0.152: C7.1 29.81,42.19 v30,42 | v30,40 30.62,39.38 U10.3
  Bottom 0.152: v30,42 v30,40
TPS-VSEL
  Top 0.152: U10.15 33.59,39.69 TP28.1 37.88,39.69 R4.2
VBAT
  Top 0.152: R25.1 44.66,28.34 48.5,24.5 48.5,4.5 46,2 22,2 JP2.7
VUMB  (via drill 0.35)  (5 unrouted)
  Top 0.152: JP2.1 22.76,21.5 v46,21.5
  Bottom 0.152: 43.25,18.89 43.15,18.99 | v46,21.5 47,22.5 47,45 49,47 60.5,47
  other vias: 70,39.5

### Text on the board
tPlace: Recovery Board Rev1.0 | BATT | LIN-ACT | DCMOTOR | LAMOTOR+ | DCM+
Document: this cap is too big | SPS | LiPo